# EAGLE design pca9535bowing (EAGLE 6.1)
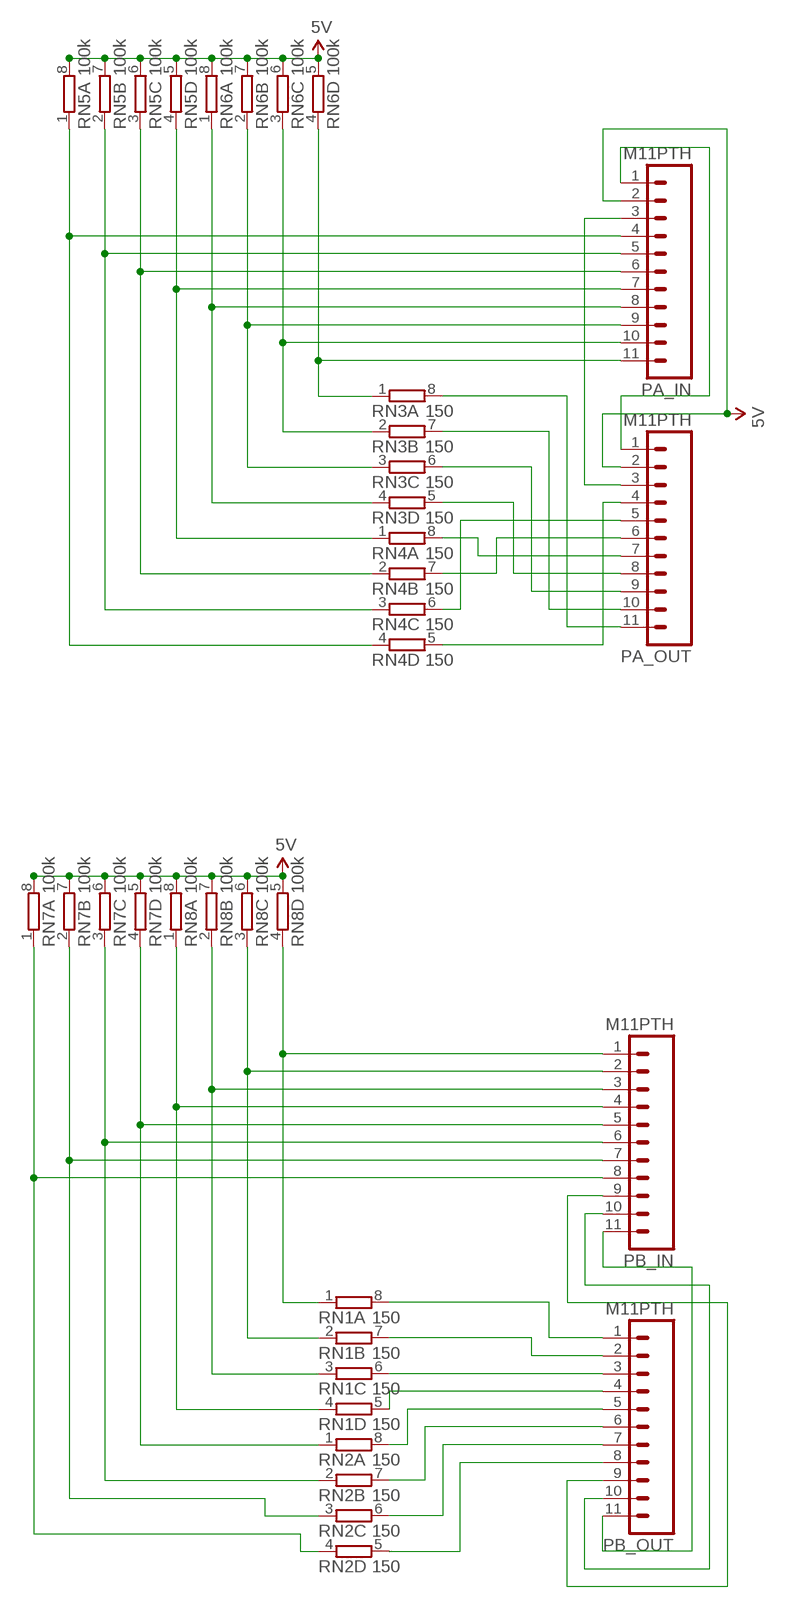
[diagram p0: schematic, sheet 1]

## Parts
PA_IN  M11PTH  [1X11]
PA_OUT  M11PTH  [1X11]
PB_IN  M11PTH  [1X11]
PB_OUT  M11PTH  [1X11]
RN1  150  4R-NCAY16  [CAY16]
RN2  150  4R-NCAY16  [CAY16]
RN3  150  4R-NCAY16  [CAY16]
RN4  150  4R-NCAY16  [CAY16]
RN5  100k  4R-NCAY16  [CAY16]
RN6  100k  4R-NCAY16  [CAY16]
RN7  100k  4R-NCAY16  [CAY16]
RN8  100k  4R-NCAY16  [CAY16]

## Nets
5V: PA_IN.2 PA_OUT.2 RN5.5 RN5.6 RN5.7 RN5.8 RN6.5 RN6.6 RN6.7 RN6.8 RN7.5 RN7.6 RN7.7 RN7.8 RN8.5 RN8.6 RN8.7 RN8.8
N$3: PB_IN.1 RN1.1 RN8.4
N$4: PB_IN.2 RN1.2 RN8.3
N$5: PB_IN.3 RN1.3 RN8.2
N$6: PB_IN.4 RN1.4 RN8.1
N$7: PB_IN.5 RN2.1 RN7.4
N$8: PB_IN.6 RN2.2 RN7.3
N$9: PB_IN.7 RN2.3 RN7.2
N$10: PB_IN.8 RN2.4 RN7.1
N$11: PA_IN.11 RN3.1 RN6.4
N$12: PA_IN.10 RN3.2 RN6.3
N$13: PA_IN.9 RN3.3 RN6.2
N$14: PA_IN.8 RN3.4 RN6.1
N$15: PA_IN.7 RN4.1 RN5.4
N$16: PA_IN.6 RN4.2 RN5.3
N$17: PA_IN.5 RN4.3 RN5.2
N$18: PA_IN.4 RN4.4 RN5.1
N$19: PA_IN.1 PA_OUT.1
N$21: PA_IN.3 PA_OUT.3
N$22: PA_OUT.4 RN4.5
N$23: PA_OUT.5 RN4.6
N$24: PA_OUT.6 RN4.7
N$25: PA_OUT.7 RN4.8
N$26: PA_OUT.8 RN3.5
N$27: PA_OUT.9 RN3.6
N$28: PA_OUT.10 RN3.7
N$29: PA_OUT.11 RN3.8
N$30: PB_IN.11 PB_OUT.11
N$31: PB_IN.10 PB_OUT.10
N$32: PB_IN.9 PB_OUT.9
N$33: PB_OUT.1 RN1.8
N$34: PB_OUT.2 RN1.7
N$35: PB_OUT.3 RN1.6
N$36: PB_OUT.4 RN1.5
N$37: PB_OUT.5 RN2.8
N$38: PB_OUT.6 RN2.7
N$39: PB_OUT.7 RN2.6
N$40: PB_OUT.8 RN2.5

## Library data of the parts
PA_IN PA_OUT PB_IN PB_OUT = SparkFun:M11: Header 11 Standard 11-pin 0.1" header. Use with straight break away headers (SKU : PRT-00116), right angle break away headers (PRT-00553), swiss pins (PRT-00743), machine pins (PRT-00117), and female headers (PRT-00115).
RN1-RN8 = resistor-dil:4R-N: Array Chip Resistor Source: RS Component / Phycomp; OC_FARNELL: unknown; OC_NEWARK: unknown

## Net classes
0 default: width 0.203 mm
1 power: width 0.254 mm

## Board
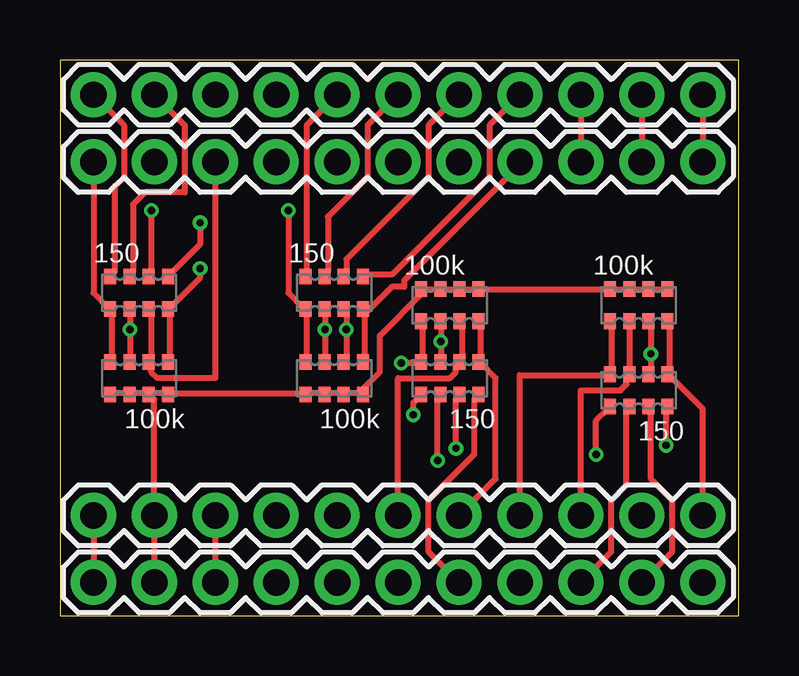
[diagram p1: board, top side]
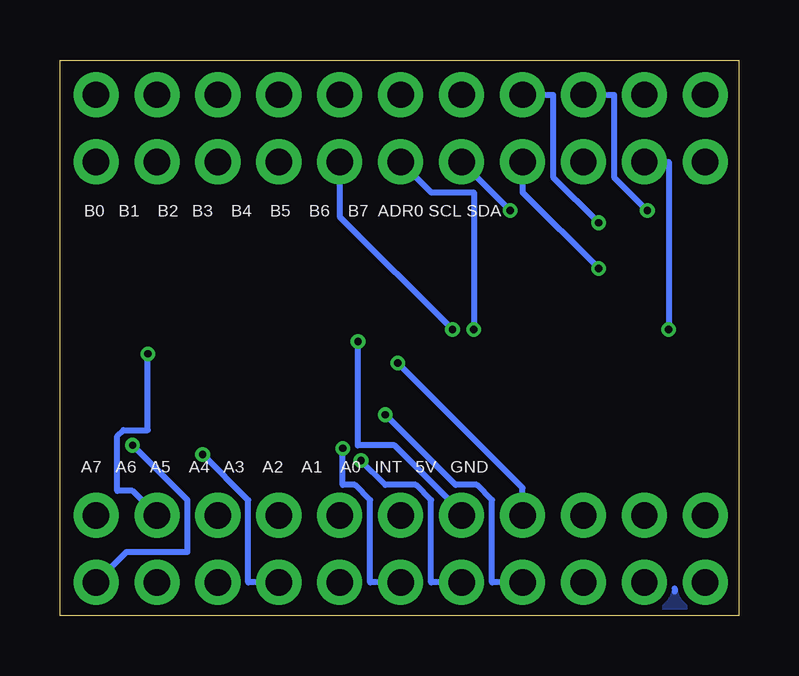
[diagram p2: board, bottom side, seen from below]

Size 28.3 x 23.16 mm. Coordinates in mm from the lower left corner, seen from the top.
Outline: 0,0 28.3,0 28.3,23.16 0,23.16 0,0
Copper layers (1*16): Top 0.035mm / dielectric 1.5mm / Bottom 0.035mm
Design rules: minimum track width 10mil, minimum drill 12mil, track to track 8mil, track to pad 8mil, pad to pad 8mil, via to via 8mil, smd to smd 0mil, copper to edge 10mil, drill to drill 10mil, minimum pad ring 10mil, minimum via ring 6mil, stop-mask expansion 2mil, vias tented up to drill 100mil, thermal gap 10mil

### Footprints (pad centres in the part's own frame; a part is rotated, then mirrored left to right if it is on the bottom)
1X11 = drill 1.1 pad 1.88: 1 0,0; 2 2.54,0; 3 5.08,0; 4 7.62,0; 5 10.16,0; 6 12.7,0; 7 15.24,0; 8 17.78,0; 9 20.32,0; 10 22.86,0; 11 25.4,0
CAY16 = smd 0.5 x 0.65: 1 -1.2,-0.675; 2 -0.4,-0.675; 3 0.4,-0.675; 4 1.2,-0.675; 5 1.2,0.675; 6 0.4,0.675; 7 -0.4,0.675; 8 -1.2,0.675

### Placement (x,y rotation side)
PA_IN  1.4,4.19 0 top
PA_OUT  1.4,1.4 0 top
PB_IN  1.4,18.92 0 top
PB_OUT  1.4,21.72 0 top
RN1  3.3,13.46 0 top
RN2  11.43,13.46 0 top
RN3  24.13,9.4 180 top
RN4  16.26,9.91 180 top
RN5  16.26,12.95 0 top
RN6  24.13,12.95 0 top
RN7  11.43,9.91 180 top
RN8  3.3,9.91 180 top

### Tracks (layer width: path | path; a pad name or v marks a point on that pad's centre or on a via)
5V
  Top 0.254: RN6.5 25.27,13.59 24.64,13.59 RN6.6 24.51,13.59 23.75,13.59 RN6.7 23.62,13.59 22.99,13.59 RN6.8 22.86,13.59 17.53,13.59 RN5.5 17.4,13.59 16.76,13.59 RN5.6 16.64,13.59 15.88,13.59 RN5.7 15.75,13.59 15.11,13.59 RN5.8 15.11,13.46 13.34,11.68 13.34,10.16 12.57,9.4 RN7.8 12.57,9.27 11.94,9.27 RN7.7 11.81,9.27 11.05,9.27 RN7.6 10.92,9.27 10.29,9.27 RN7.5 10.16,9.27 4.57,9.27 RN8.8 4.45,9.27 3.81,9.27 RN8.7 | RN8.5 2.16,9.27 2.79,9.27 RN8.6 2.92,9.27 3.68,9.27 RN8.7 | RN8.7 3.81,9.14 3.94,9.02 PA_IN.2 PA_OUT.2
GND
  Bottom 0.254: 2.67,1.14 2.67,1.01
  pour Bottom (isolate 0.254): 0,23.24 0,0 28.32,0 28.32,23.24
N$3
  Top 0.254: RN8.4 2.16,10.67 2.16,12.7 RN1.1 2.03,12.83 1.4,13.46 PB_IN.1
N$4  (via drill 0.3)
  Top 0.254: RN8.3 2.92,10.67 v2.92,11.94 2.92,12.7 RN1.2
  Bottom 0.254: v2.92,11.94 2.92,18.92 PB_IN.2
N$5
  Top 0.254: RN1.3 3.81,12.7 3.81,10.67 RN8.2 3.81,10.54 3.81,10.16 4.06,9.91 6.48,9.91 PB_IN.3
N$6  (via drill 0.3)
  Top 0.254: RN8.1 4.57,10.67 4.57,12.7 RN1.4 4.57,12.83 5.84,14.1 v5.84,14.48
  Bottom 0.254: v5.84,14.48 9.02,17.65 PB_IN.4
N$7  (via drill 0.3)
  Top 0.254: RN7.4 10.29,10.67 10.29,12.7 RN2.1 10.16,12.83 9.53,13.46 v9.53,16.89
  Bottom 0.254: PB_IN.5 v9.53,16.89
N$8  (via drill 0.3)
  Top 0.254: RN7.3 11.05,10.67 v11.05,11.94 11.05,12.7 RN2.2
  Bottom 0.254: v11.05,11.94 11.05,17.65 12.83,17.65 PB_IN.6
N$9  (via drill 0.3)
  Top 0.254: RN7.2 11.94,10.67 v11.94,11.94 11.94,12.7 RN2.3
  Bottom 0.254: v11.94,11.94 16.64,16.64 PB_IN.7
N$10
  Top 0.254: RN7.1 12.7,10.67 12.7,12.7 RN2.4 12.83,12.7 13.84,13.72 14.35,13.72 14.35,13.97 19.18,18.8 PB_IN.8
N$11
  Top 0.254: RN6.4 25.4,12.19 25.4,10.16 RN3.1 25.4,10.03 26.8,8.64 PA_IN.11
N$12  (via drill 0.3)
  Top 0.254: RN3.2 24.64,10.16 v24.64,10.92 24.64,12.19 RN6.3
  Bottom 0.254: v24.64,10.92 24.64,7.75 25.65,7.75 25.91,7.49 25.91,5.21 25.27,5.21 PA_IN.10
N$13
  Top 0.254: RN6.2 23.75,12.19 23.75,10.16 RN3.3 23.62,10.03 23.62,9.65 23.37,9.4 21.72,9.4 PA_IN.9
N$14
  Top 0.254: RN6.1 22.99,12.19 22.99,10.16 RN3.4 22.86,10.03 19.18,10.03 PA_IN.8
N$15
  Top 0.254: RN5.4 17.53,12.19 17.53,10.67 RN4.1 17.53,10.54 18.16,9.91 18.16,5.71 PA_IN.7
N$16
  Top 0.254: RN5.3 16.76,12.19 16.76,10.67 RN4.2 16.64,10.54 16.51,10.41 16.51,10.16 16.26,9.91 14.1,9.91 PA_IN.6
N$17  (via drill 0.3)
  Top 0.254: RN4.3 15.88,10.67 v15.88,11.43 15.88,12.19 RN5.2
  Bottom 0.254: v15.88,11.43 15.88,7.11 14.35,7.11 11.56,4.32 PA_IN.5
N$18  (via drill 0.3)
  Top 0.254: RN5.1 15.11,12.19 15.11,10.67 RN4.4 14.99,10.54 v14.22,10.54
  Bottom 0.254: v14.22,10.54 9.02,5.33 PA_IN.4
N$19
  Top 0.254: PA_IN.1 PA_OUT.1
N$21
  Top 0.254: PA_IN.3 PA_OUT.3
N$22  (via drill 0.3)
  Top 0.254: v14.73,8.38 14.73,8.89 14.99,9.14 RN4.5
  Bottom 0.254: v14.73,8.38 11.81,5.46 10.92,5.46 10.29,4.83 10.29,1.4 PA_OUT.4
N$23  (via drill 0.3)
  Top 0.254: v15.75,6.48 15.75,9.14 RN4.6
  Bottom 0.254: v15.75,6.48 14.73,5.46 13.46,5.46 12.83,4.83 12.83,1.4 PA_OUT.5
N$24  (via drill 0.3)
  Top 0.254: v16.51,6.99 16.51,9.02 16.64,9.14 RN4.7
  Bottom 0.254: v16.51,6.99 16.51,5.46 16,5.46 15.37,4.83 15.37,1.4 PA_OUT.6
N$25
  Top 0.254: PA_OUT.7 15.37,2.67 15.37,4.83 17.27,6.73 17.27,9.02 17.4,9.14 RN4.8
N$26  (via drill 0.3)
  Top 0.254: v22.35,6.73 22.35,8.13 22.86,8.64 RN3.5
  Bottom 0.254: v22.35,6.73 20.45,4.83 20.45,1.4 PA_OUT.8
N$27
  Top 0.254: PA_OUT.9 22.99,2.67 22.99,4.83 23.62,5.46 23.62,8.64 RN3.6
N$28
  Top 0.254: PA_OUT.10 25.53,2.67 25.53,4.83 24.64,5.71 24.64,8.64 RN3.7
N$29  (via drill 0.3)
  Top 0.254: v25.27,7.11 25.27,8.64 RN3.8
  Bottom 0.254: v25.27,7.11 22.99,4.83 22.99,2.67 25.53,2.67 PA_OUT.11
N$30
  Top 0.254: PB_OUT.11 PB_IN.11
N$31
  Top 0.254: PB_OUT.10 PB_IN.10
N$32
  Top 0.254: PB_OUT.9 PB_IN.9
N$33
  Top 0.254: PB_OUT.1 2.67,20.45 2.67,18.29 2.29,17.91 2.29,14.35 2.16,14.22 RN1.8
N$34
  Top 0.254: PB_OUT.2 5.21,20.45 5.21,17.65 3.56,17.65 3.05,17.14 3.05,14.35 2.92,14.22 RN1.7
N$35  (via drill 0.3)
  Top 0.254: v3.81,16.89 3.81,14.22 RN1.6
  Bottom 0.254: v3.81,16.89 5.21,18.29 5.21,21.72 PB_OUT.3
N$36  (via drill 0.3)
  Top 0.254: v5.84,16.38 5.84,15.49 4.57,14.22 RN1.5
  Bottom 0.254: v5.84,16.38 7.75,18.29 7.75,21.72 PB_OUT.4
N$37
  Top 0.254: PB_OUT.5 10.29,20.45 10.29,14.22 RN2.8
N$38
  Top 0.254: PB_OUT.6 12.83,20.45 12.83,18.29 11.18,16.64 11.18,14.35 11.05,14.22 RN2.7
N$39
  Top 0.254: PB_OUT.7 15.37,20.45 15.37,18.29 11.94,14.86 11.94,14.22 RN2.6
N$40
  Top 0.254: PB_OUT.8 17.91,20.45 17.91,18.29 13.84,14.22 12.7,14.22 RN2.5

### Text on the board
bNames: B0 B1 B2 B3 B4 B5 B6 B7 ADR0 SCL SDA | A7 A6 A5 A4 A3 A2 A1 A0 INT 5V GND